# Altium schematic sheet 0_System.SchDoc
size A3
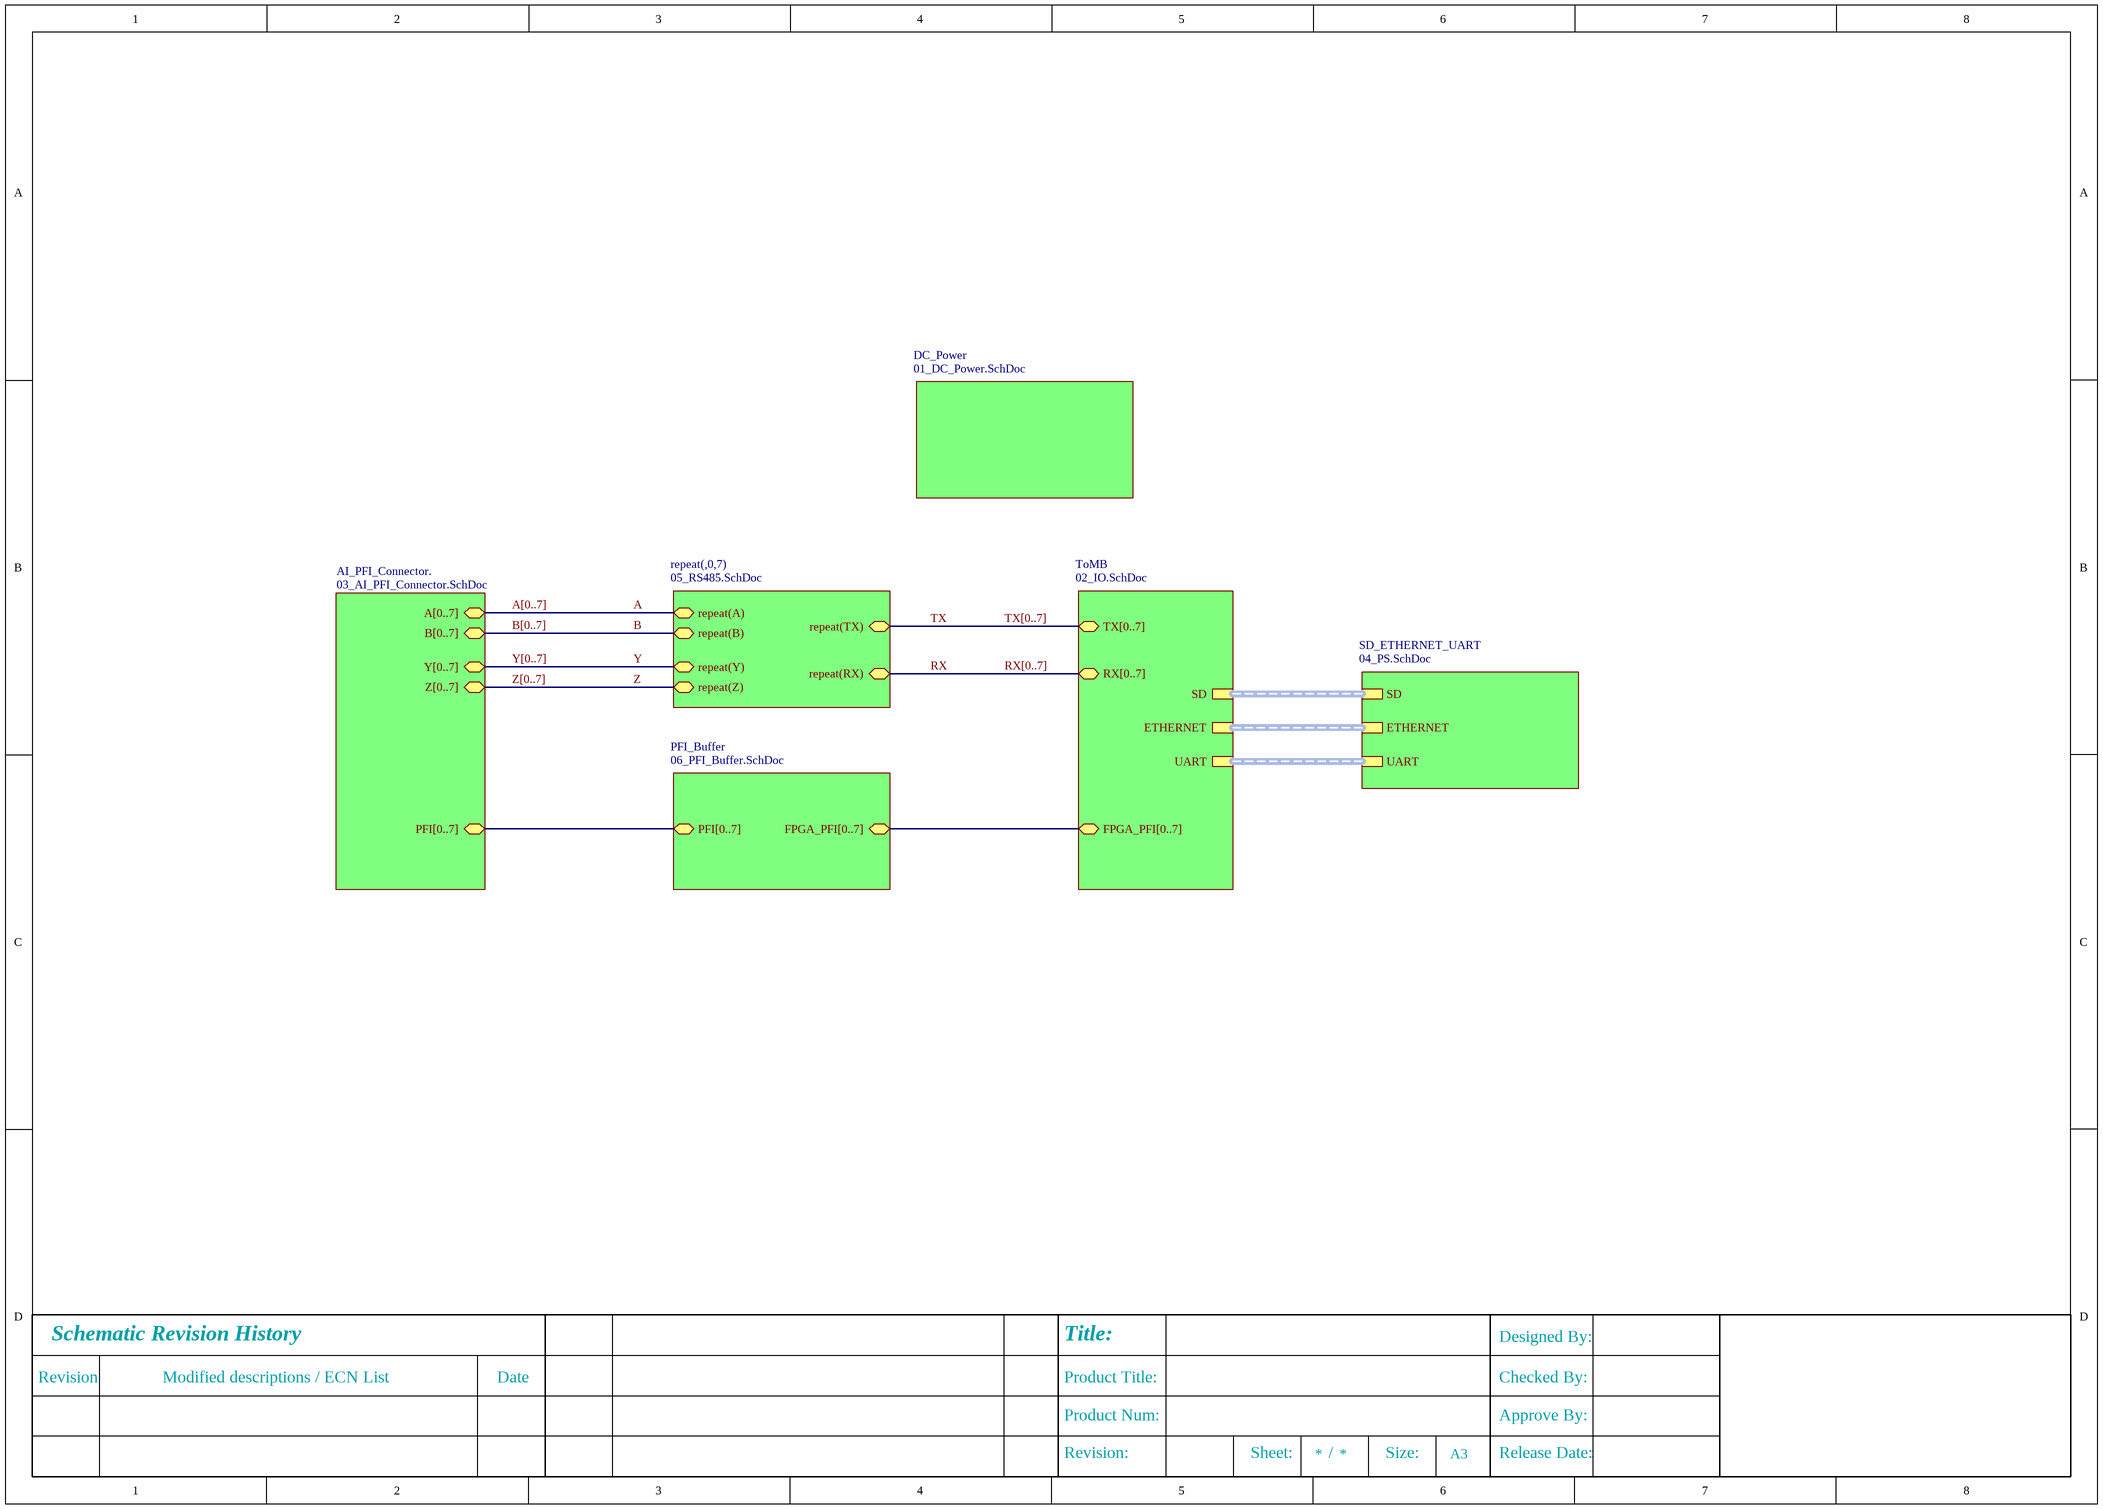
[diagram p0: 0_System.SchDoc]

## Sub-sheets
AI_PFI_Connector. = 03_AI_PFI_Connector.SchDoc: Y[0..7] (bidir), Z[0..7] (bidir), PFI[0..7] (bidir), B[0..7] (bidir), A[0..7] (bidir)
DC_Power = 01_DC_Power.SchDoc: no entries
PFI_Buffer = 06_PFI_Buffer.SchDoc: PFI[0..7] (bidir), FPGA_PFI[0..7] (bidir)
repeat(,0,7) = 05_RS485.SchDoc: repeat(TX) (bidir), repeat(Z) (bidir), repeat(A) (bidir), repeat(B) (bidir), repeat(RX) (bidir), repeat(Y) (bidir)
SD_ETHERNET_UART = 04_PS.SchDoc: ETHERNET (harness ETHERNET), SD (harness SD), UART (harness UART)
ToMB = 02_IO.SchDoc: FPGA_PFI[0..7] (bidir), TX[0..7] (bidir), RX[0..7] (bidir), SD (harness SD), UART (harness UART), ETHERNET (harness ETHERNET)

## Nets
A: sheet repeat(,0,7)/repeat(A)
B: sheet repeat(,0,7)/repeat(B)
RX: sheet repeat(,0,7)/repeat(RX)
TX: sheet repeat(,0,7)/repeat(TX)
Y: sheet repeat(,0,7)/repeat(Y)
Z: sheet repeat(,0,7)/repeat(Z)

## Buses and harness runs
bus A[0..7] = sheet AI_PFI_Connector./A[0..7]
bus B[0..7] = sheet AI_PFI_Connector./B[0..7]
bus RX[0..7] = sheet ToMB/RX[0..7]
bus sheet AI_PFI_Connector./PFI[0..7] = sheet PFI_Buffer/PFI[0..7]
bus sheet PFI_Buffer/FPGA_PFI[0..7] = sheet ToMB/FPGA_PFI[0..7]
bus TX[0..7] = sheet ToMB/TX[0..7]
bus Y[0..7] = sheet AI_PFI_Connector./Y[0..7]
bus Z[0..7] = sheet AI_PFI_Connector./Z[0..7]
harness sheet SD_ETHERNET_UART/ETHERNET = sheet ToMB/ETHERNET
harness sheet SD_ETHERNET_UART/SD = sheet ToMB/SD
harness sheet SD_ETHERNET_UART/UART = sheet ToMB/UART

## Notes on the sheet
- Revision
- Schematic Revision History
- Modified descriptions / ECN List
- Date
- Product Title:
- Title:
- Checked By:
- Designed By:
- Revision:
- Product Num:
- Sheet:
- /
- Size:
- A3
- Approve By:
- Release Date:
- Title
- Date:
- Number:
- Time:
- Sheet
- of
- File: